# Altium schematic sheet P1_1.schdoc
size 420 x 298 mm; Symbol: Sheet-Symbol_A3; Company: 深圳嘉立创科技发展有限公司; Drawed: 嘉立创EDA; Reviewed: 嘉立创EDA; Version: V0.1; Page Size: A3; Part Number: JLCPCB-001; @Page No: 1; Convert to PCB: yes; Add into BOM: yes; @Page Name: P1_1; @Project Name: 平衡小车（大鱼电子）; @Page Count: 1; @Update Date: 2024-01-26; @Create Date: 2023-04-02; @Schematic Name: Schematic2_1; Device: Sheet-Symbol_A3; SheetNumber: 1; SheetTotal: 1
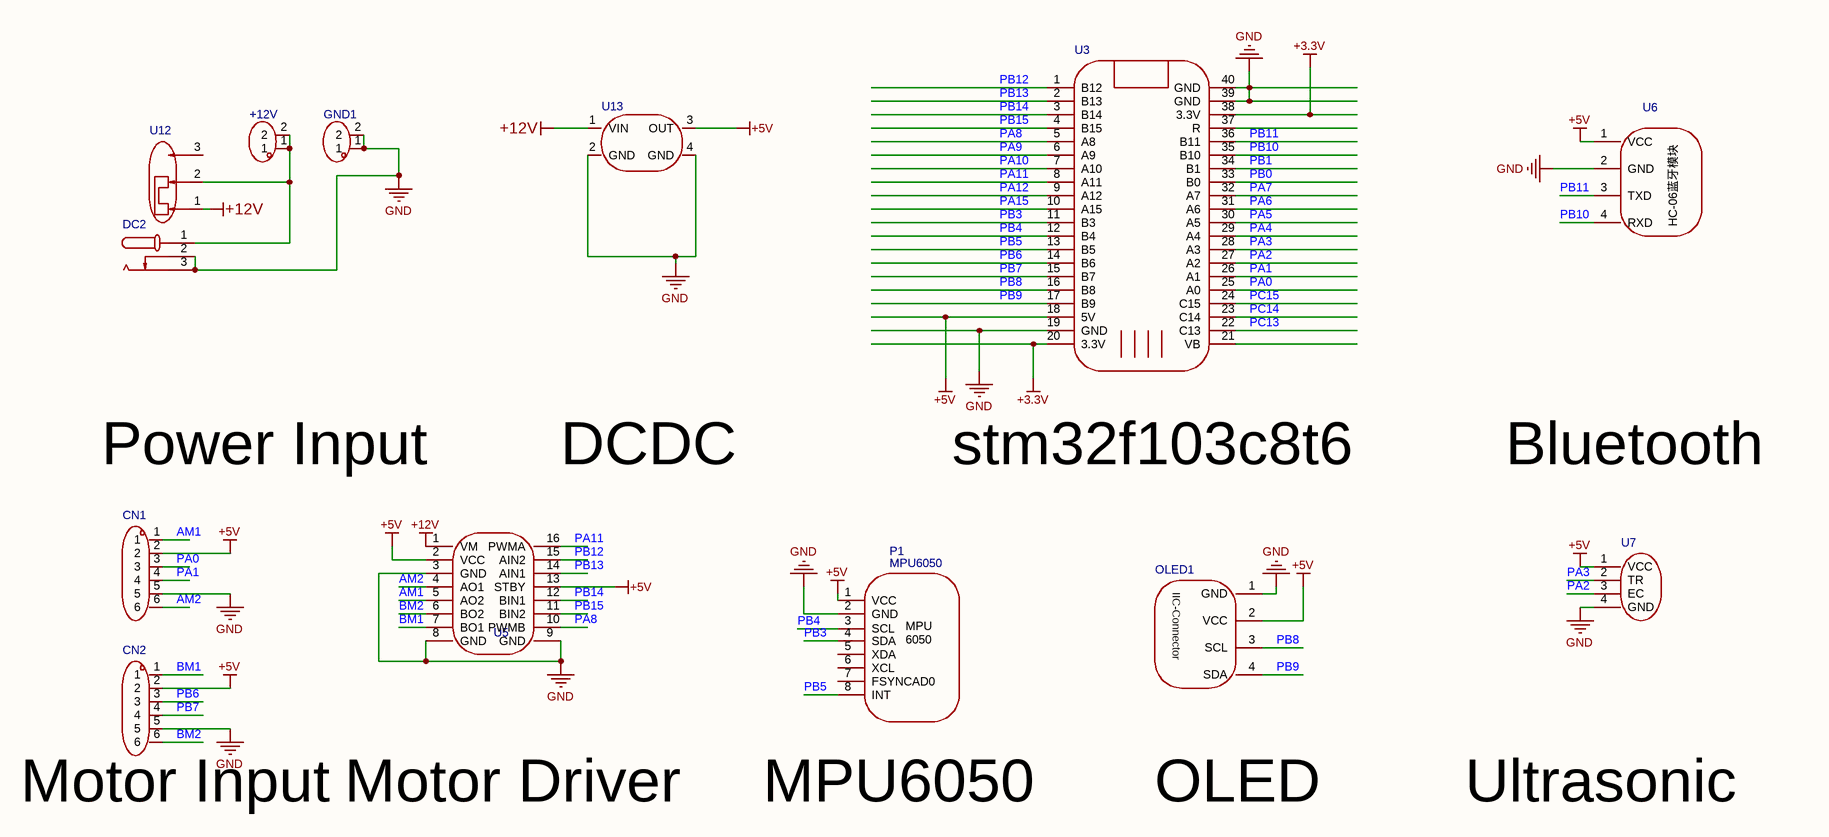
[diagram p0: P1_1.schdoc]

## Parts
+12V  (no value)  [HDR-TH_2P-P2.54-V]
CN1  PH2.0-6P  [PH2.0-6P 直针端子座]  (value not drawn)
CN2  PH2.0-6P  [PH2.0-6P 直针端子座]  (value not drawn)
DC2  (no value)  [DC-IN-TH_KH-DC-005-2.5]
GND1  (no value)  [HDR-TH_2P-P2.54-V]
OLED1  (no value)  [0.96OLED_4P]
P1  MPU6050  [MPU6050]
U3  (no value)  [STM32F103C8T6核心板]
U5  (no value)  [TB6612FNG Module - 8pin x 2]
U6  (no value)  [DIP-1X4P2.54（HC-06蓝牙模块）]
U7  (no value)  [排母-4P]
U12  SS-12D10-G5  [SW-TH_SS-12D10-G050]  (value not drawn)
U13  (no value)  [MP1584模块]

## Nets
+3.3V: U3.20(3.3V) U3.38(3.3V)
+5V: CN1.2 CN2.2 OLED1.2(VCC) P1.1(VCC) U3.18(5V) U5.2(VCC) U5.13(STBY) U6.1(VCC) U7.1(VCC) U13.3(OUT)
+12V: U5.1(VM) U12.1 U13.1(VIN)
GND: CN1.5 CN2.5 DC2.2 DC2.3 GND1.1 GND1.2 OLED1.1(GND) P1.2(GND) U3.19(GND) U3.39(GND) U3.40(GND) U5.3(GND) U5.8(GND) U5.9(GND) U6.2(GND) U7.4(GND) U13.2(GND) U13.4(GND)
AM1: CN1.1 U5.5(AO2)
AM2: CN1.6 U5.4(AO1)
BM1: CN2.1 U5.7(BO1)
BM2: CN2.6 U5.6(BO2)
PA0: CN1.3 U3.25(A0)
PA1: CN1.4 U3.26(A1)
PA2: U3.27(A2) U7.3(EC)
PA3: U3.28(A3) U7.2(TR)
PA4: U3.29(A4)
PA5: U3.30(A5)
PA6: U3.31(A6)
PA7: U3.32(A7)
PA8: U3.5(A8) U5.10(PWMB)
PA9: U3.6(A9)
PA10: U3.7(A10)
PA11: U3.8(A11) U5.16(PWMA)
PA12: U3.9(A12)
PA15: U3.10(A15)
PB0: U3.33(B0)
PB1: U3.34(B1)
PB3: P1.4(SDA) U3.11(B3)
PB4: P1.3(SCL) U3.12(B4)
PB5: P1.8(INT) U3.13(B5)
PB6: CN2.3 U3.14(B6)
PB7: CN2.4 U3.15(B7)
PB8: OLED1.3(SCL) U3.16(B8)
PB9: OLED1.4(SDA) U3.17(B9)
PB10: U3.35(B10) U6.4(RXD)
PB11: U3.36(B11) U6.3(TXD)
PB12: U3.1(B12) U5.15(AIN2)
PB13: U3.2(B13) U5.14(AIN1)
PB14: U3.3(B14) U5.12(BIN1)
PB15: U3.4(B15) U5.11(BIN2)
PC13: U3.22(C13)
PC14: U3.23(C14)
PC15: U3.24(C15)
Net+12V_1: +12V.1 +12V.2 DC2.1 U12.2

Not connected (* = marked no-connect by the designer): P1 5(XDA) 6(XCL) 7(FSYNCAD0); U3 21(VB) 37(R); U12 3

## Notes on the sheet
- Power Input
- DCDC
- stm32f103c8t6
- Bluetooth
- (near CN2) Motor Input
- Motor Driver
- MPU6050
- OLED
- Ultrasonic
- 1
- 2
- 3
- 4
- 5
- 6
- A
- B
- C
- Update Date
- D
- Schematic
- Page
- Create Date
- Part Number
- Reviewed
- Drawed
- VER
- SIZE
- PAGE
- OF
- (in symbol 0.96OLED_4P) IIC-Connector
- (in symbol MPU6050) MPU / 6050
- (in symbol 蓝牙模块HC-06) HC-06蓝牙模块

## Library data of the parts
+12V GND1 = 排针2P: 2.54 1*2P 直排针 0.8u镀金 PBT RoHS,针长3*6mm; Manufacturer: Nextron(台湾正凌); Symbol: Z-211-0211-0021-001; AddInBom: yes; Number of Positions: 2; Connector Type: 排针; Pitch: 0.100; ModelId: 79b2e9f2d70a4d68a1b7098f27c6d4c5; ModelName: HDR-M-2.54_1x2_1; ModelTransform: 200,100,0,0,0,0,0,0,-118.1; Device: 排针2P; SupplierPart: C152154; ManufacturerPart: Z-211-0211-0021-001; LCSC On Sale: 1; Supplier Footprint: Through Hole,P=2.54mm; JLCPCB Part Class: Extended Part; JLCPCB Stock Number: 5280; Datasheet: https://atta.szlcsc.com/upload/public/pdf/source/20171225/C152154_15141883746031203216.pdf; Supplier: LCSC; ConvertToPcb: yes; Number of Rows: 1; Row Spacing: -; Mounting Type: 通孔; Contact Type: 公形引脚; Contact Material: 黄铜
CN1 CN2 = PH2.0-6P: Manufacturer: CAX(创都); ManufacturerPart: PH2.0-4P; Pin Type: IN; AddInBom: yes; Symbol: PH2.0-6P; Device: PH2.0-6P; ConvertToPcb: yes; Supplier: LCSC; SupplierPart: C722763; JLCPCB Part Class: Extended Part
DC2 = KH-DC-005-2.5: 连接器类型:DC电源插座;安装方式:弯插;触点内径:-;触点外径:6.4mm;额定电流:1A;额定电压:30V;工作温度范围:-25~+70;; Manufacturer: kinghelm(金航标); AddInBom: yes; ModelId: d1670a3303e04fdaa20421e982949edc; ModelTransform: 368.1,570.9,0,270,0,0,-127.4,85.2,-153.5; Connector Type: DC电源插座; Outside Contact Diameter: 6.4mm; Current Rating (Max): 1A; Voltage Rating (Max): 30V; Symbol: KH-DC-005-2.5; Device: KH-DC-005-2.5; Operating Temperature Range: -25~+70; LCSC Part Name: DC电源插座 外径:6.4mm; SupplierPart: C2847170; ManufacturerPart: KH-DC-005-2.5; Supplier Footprint: 插件; JLCPCB Part Class: Extended Part; Datasheet: https://atta.szlcsc.com/upload/public/pdf/source/20210716/C2847170_7F0110A0BEDEE81C68B76DF87AC8DA16.pdf; Supplier: LCSC; ConvertToPcb: yes; ModelName: DC-IN-TH_KH-DC-005-2.5; Mounting Style: 弯插; Inside Contact Diameter: -
OLED1 = 0.96OLED_4P: Symbol: 0.96OLED_4P_MODULE_JX; AddInBom: yes; ModelId: 4c3103edf0b74d7d9df8496f32a6dfdc; ModelName: OLED_0.96_IIC_4P; ModelTransform: 1114.96,1055.12,362.83,0,0,0,0,-450.79,-188.98; Device: 0.96OLED_4P; LCSC Part Name: 0.96OLED_4P_MODULE_JX; SupplierPart: C9900004566; ManufacturerPart: 0.96OLED_4P_MODULE_JX; Supplier Footprint: THrough hole; JLCPCB Part Class: Extended Part; Supplier: LCSC; ConvertToPcb: yes
P1 = MPU6050: ConvertToPcb: yes; Origin Footprint: MPU6050; Device: MPU6050; Symbol: MPU6050; AddInBom: yes
U3 = stm32f103c8t6最小系统板: ConvertToPcb: yes; Symbol: STM32F103C8T6核心板; Device: stm32f103c8t6最小系统板; AddInBom: yes
U5 = TB6612FNG模块: Pin Type: In; Add into BOM: yes; Symbol: TB6612FNG模块; Device: TB6612FNG模块; Convert to PCB: yes
U6 = 蓝牙模块HC-06: Pin Type: IN; AddInBom: yes; Symbol: 蓝牙模块HC-06; Device: 蓝牙模块HC-06; ConvertToPcb: yes
U7 = HC-SR04_1: ConvertToPcb: yes; Symbol: HC-SR04; Device: HC-SR04_1; AddInBom: yes
U12 = SS-12D10-G5: 电路结构:单刀双掷;安装方式:直插;开关颜色:黑色;滑钮形状:矩形柱状;引脚样式:PC引脚;开关长度:12.7mm;开关宽度:6.7mm;开关高度:11.3mm;; Manufacturer: DEALON(德艺隆); AddInBom: yes; ModelId: 15e778c65cea4653be5d87f0502c04df; ModelTransform: 499.999,263.779,0,0,0,0,0,0,-196.85; Circuit: 单刀双掷; Actuator Color: 黑色; Actuator Style: 矩形柱状; Pin Style: PC引脚; Switch Length: 12.7mm; Switch Width: 6.7mm; Switch Height: 11.3mm; Symbol: SS-12D10-G5; Device: SS-12D10-G5; LCSC Part Name: 插件大电流拨动开关; SupplierPart: C2998777; ManufacturerPart: SS-12D10-G5; Supplier Footprint: 插件; JLCPCB Part Class: Extended Part; Datasheet: https://atta.szlcsc.com/upload/public/pdf/source/20220428/E10CB334ACBAF32CF4AF8D87DA871CD3.pdf; Supplier: LCSC; ConvertToPcb: yes; FootprintName: SW-TH_SS-12D10-G050; ModelName: SW-TH_SS-12D10-G050; Mounting Style: 直插
U13 = MP1584模块: Pin Type: IN; AddInBom: yes; Symbol: MP1584模块; Device: MP1584模块; ConvertToPcb: yes; FootprintName: MP1584模块